# EAGLE design Presure Sensor Breakout (EAGLE 9.2.0)
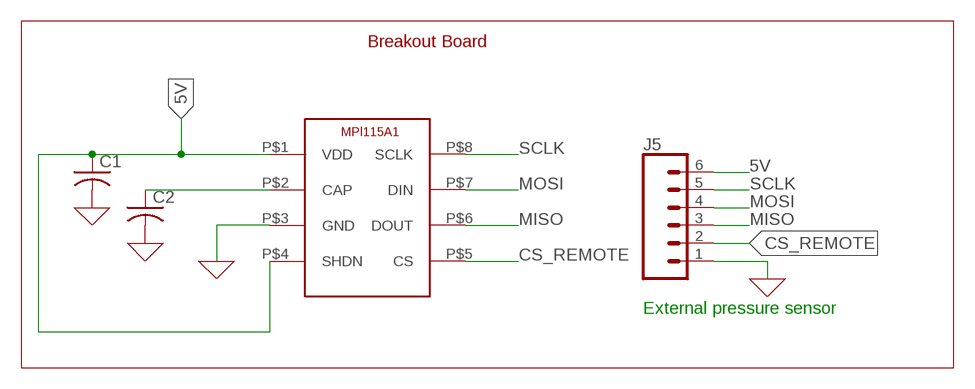
[diagram p0: schematic, sheet 1]

## Parts
C1  C-USC0805  [C0805]
C2  C-USC0805  [C0805]
J5  CONN_06LOCK_LONGPADS  [1X06_LOCK_LONGPADS]
U$1  MPL115A1  [MPL115A1]

## Nets
0: C1.2 C2.2 J5.1 U$1.P$3(GND) ; supply symbol labelled GND
5V: C1.1 J5.6 U$1.P$1(VDD) U$1.P$4(SHDN)
CS_REMOTE: J5.2 U$1.P$5(CS)
MISO: J5.3 U$1.P$6(DOUT)
MOSI: J5.4 U$1.P$7(DIN)
N$1: C2.1 U$1.P$2(CAP)
SCLK: J5.5 U$1.P$8(SCLK)

## Notes on the sheet
- Breakout Board
- External pressure sensor

## Library data of the parts
C1 C2 = rcl:C-US: CAPACITOR, American symbol; SPICEPREFIX: C
J5 = SparkFun-Connectors:CONN_06: Multi connection point. Often used as Generic Header-pin footprint for 0.1 inch spaced/style header connections On any of the 0.1 inch spaced packages, you can populate with these: Break Away Headers - Straight <https://www.sparkfun.com/products/116> (PRT-00116) Break Away Male Headers - Right Angle <https://www.sparkfun.com/products/553> (PRT-00553) Female Headers <https://www.sparkfun.com/products/115> (PRT-00115) Break Away Headers - Machine Pin <https://www.sparkfun.com/products/117> (PRT-00117) Break Away Female Headers - Swiss Machine Pin <https://www.sparkfun.com/products/743> (PRT-00743) Arduino Stackable Header - 6 Pin <https://www.sparkfun.com/products/9280> (PRT-09280) For SCREWTERMINALS and SPRING TERMINALS visit here: Screw Terimnals on SparkFun.com <https://www.sparkfun.com/search/results?term=Screw+Terminals> (5mm/3.5mm/2.54mm spacing) This device is also useful as a general connection point to wire up your design to another part of your project. Our various solder wires solder well into these plated through hole pads. Hook-Up Wire - Assortment (Stranded, 22 AWG) <https://www.sparkfun.com/products/11375> (PRT-11375) Hook-Up Wire - Assortment (Solid Core, 22 AWG) <https://www.sparkfun.com/products/11367> (PRT-11367) View the entire wire category on our website here <https://www.sparkfun.com/categories/141>
U$1 = Smart fan:MPL115A1

## Board
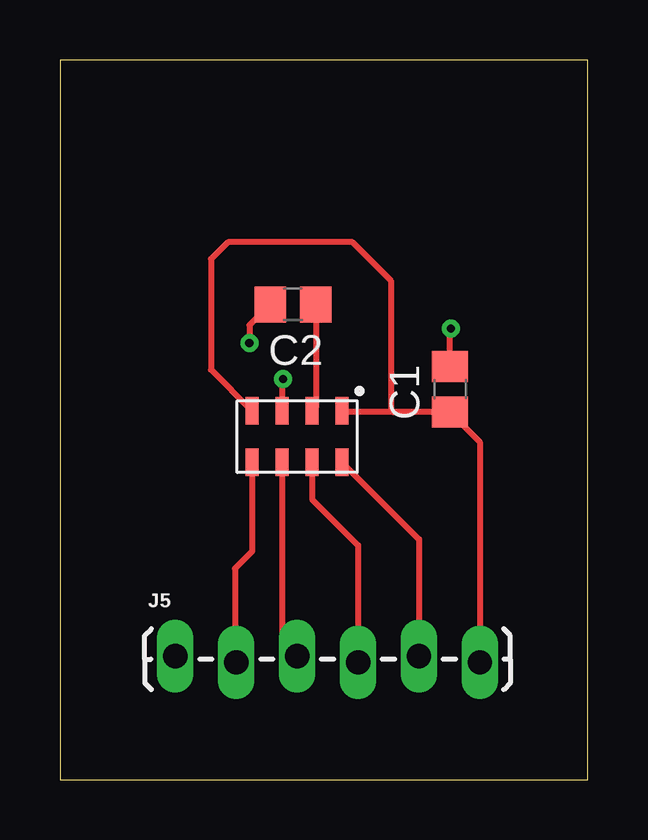
[diagram p1: board, top side]
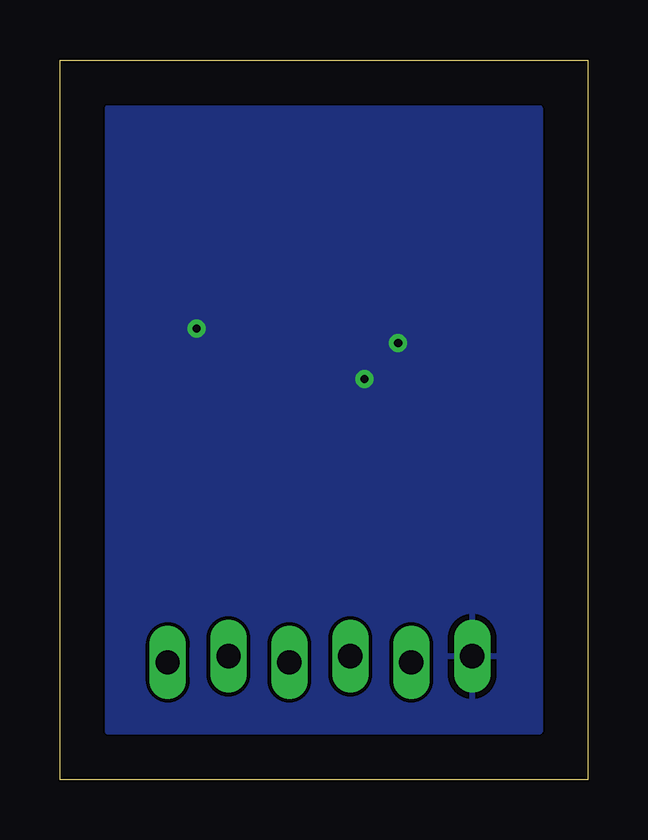
[diagram p2: board, bottom side, seen from below]

Size 22 x 30 mm. Coordinates in mm from the lower left corner, seen from the top.
Outline: 0,0 22,0 22,30 0,30 0,0
Copper layers (1*16): Top 0.035mm / dielectric 1.5mm / Bottom 0.035mm
Design rules "default": minimum track width 6mil, minimum drill 0.35mm, track to track 6mil, track to pad 6mil, pad to pad 6mil, via to via 6mil, smd to smd 6mil, copper to edge 40mil, drill to drill 6mil, minimum pad ring 10mil, minimum via ring 8mil, stop-mask expansion 4mil, vias tented up to drill 0mil, thermal gap 10mil

### Footprints (pad centres in the part's own frame; a part is rotated, then mirrored left to right if it is on the bottom)
C0805 = smd 1.3 x 1.5: 1 -0.95,0; 2 0.95,0
1X06_LOCK_LONGPADS = drill 1.016 long: 1 0,0; 2 2.54,-0.254; 3 5.08,0; 4 7.62,-0.254; 5 10.16,0; 6 12.7,-0.254
MPL115A1 = smd 1.15 x 0.55: P$1 -1.075,1.875; P$2 -1.075,0.625; P$3 -1.075,-0.625; P$4 -1.075,-1.875; P$5 1.075,-1.875; P$6 1.075,-0.625; P$7 1.075,0.625; P$8 1.075,1.875

### Placement (x,y rotation side)
C1  16.27,16.27 90 top
C2  9.72,19.81 180 top
J5  4.81,5.14 0 top
U$1  9.89,14.3 270 top

### Tracks (layer width: path | path; a pad name or v marks a point on that pad's centre or on a via)
0  (via drill 0.35)
  Top 0.254: C1.2 16.27,18.8 v16.3,18.8 | C2.2 7.9,18.94 v7.9,18.2 | U$1.P$3 v9.3,16.7
  pour Bottom: 2,2 20,2 20,28 2,28
5V
  Top 0.254: J5.6 17.51,14.08 C1.1 13.9,15.32 | 13.9,15.32 11.82,15.32 U$1.P$1 | U$1.P$4 6.3,17.09 6.3,21.7 7,22.4 12.2,22.4 13.8,20.8 13.8,15.42 13.9,15.32
CS_REMOTE
  Top 0.254: U$1.P$5 8.02,9.52 7.3,8.8 7.3,4.94 J5.2
MISO
  Top 0.254: U$1.P$6 9.27,5.76 J5.3
MOSI
  Top 0.254: U$1.P$7 10.52,11.69 12.43,9.77 J5.4
N$1
  Top 0.254: U$1.P$2 10.67,15.53 C2.1
SCLK
  Top 0.254: U$1.P$8 14.97,10.02 J5.5